# Altium schematic sheet Sheet1.SchDoc
size A4; SheetNumber: 1; SheetTotal: 1
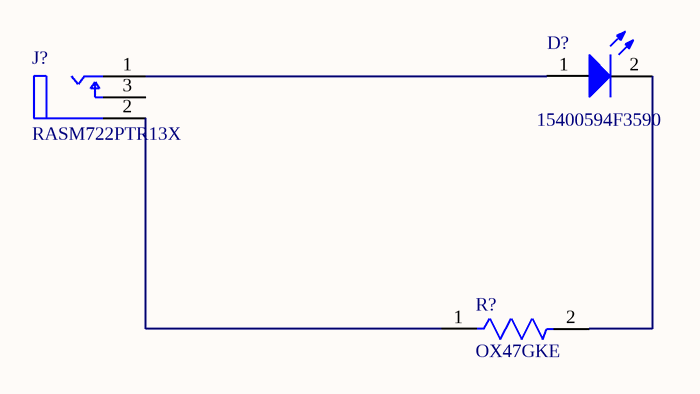
[diagram p0: Sheet1.SchDoc]

## Parts
D?  15400594F3590  [WL-TIRC_5mm]
J?  RASM722PTR13X  [FP-RASM722PTR13X-MFG]
R?  OX47GKE  [FP-OX-MFG]

## Nets
NetD?_1: D?.1(A) J?.1(TIP_TERMINAL(CENTER_PIN))
NetD?_2: D?.2(K) R?.2
NetJ?_2: J?.2(SLEEVE_TERMINAL) R?.1

Not connected (* = marked no-connect by the designer): J? 3(SHUNT_TERMINAL)

## Library data of the parts
D? = CMP-03913-110288041-3: Led, 5Mm, 940Nm, 30Mw/Sr, Th Rohs Compliant: Yes; Manufacturer Lifecycle Status: ACTIVE; Forward Voltage: 1.3V; Forward Current: 1A; Max Reverse Voltage (DC): 5V; YEOL: 1 = Estimated lifetime > 10 years; Viewing Angle: 30°; Min Operating Temperature: -40°C; Height: 8.6mm; Length: 5.8mm; Width: 5mm; Max Operating Temperature: 85°C; Lifecycle Status: Production; RoHS: Compliant; Peak Wavelength: 940nm
J? = CMP-47995-000002-1: CONN PWR JACK 2.1X5.5MM SOLDER; Shielding: Unshielded; Gender: Male; Current Rating: 5A; Termination: Solder; Contact Material: Copper Alloy; Package Quantity: 120; Case/Package: SMD/SMT; Contact Plating: Tin; Connector Type: Jack; Housing Material: Thermoplastic; Mount: Surface Mount; Housing Color: Black; Color: Black
R? = CMP-00273-00060511-1: OX47GKE OX FIXED RESISTOR Axial Through Hole Resistor ±10% -1000/ -1600ppm/C 4.7Ohm 1W; NexarPartId: 60511; Voltage Rating: 300V; Lead Length: 38mm; Resistance: 4.7Ω; Temperature Coefficient: 300ppm/°C; Wire/Cable Diameter: 787.4µm; Lead Diameter: 800µm; Number of Terminations: 2; Min Operating Temperature: -40°C; Mount: Through Hole; Tolerance: 10%; Voltage Rating (DC): 300V; Power Rating: 1W; Length: 16.51mm; Diameter: 5.5mm; Features: Moisture Resistant; Max Power Dissipation: 1W; Termination: Axial; Max Operating Temperature: 220°C; Lead Free: Lead Free; Number of Pins: 2; Height: 6.5mm; RoHS: Compliant; REACH SVHC: Unknown; Packaging: Bulk; Composition: Ceramic; Case/Package: Axial; Material: Ceramic